# Altium schematic sheet 8-Controller.SchDoc
size A; SPICEModelCacheDTLPPUMU: <root> / <DocumentId>DTLPPUMU</DocumentId> / <CacheFrame Number="0"> / <Model Name="xtal" Kind="CKT"> / <Text>*Generic type:crystal pkg:HC33/51 / .SUBCKT XTAL 1 2 PARAMS: FREQ=1Meg RS=750 C=13pf Q=1000 / LX 1 3 {((Q*RS)/(6.2831852*FREQ))} IC=0.5M / CX 3 4 {(1/(Q*6.2831852*FREQ*RS))} / C0 1 2 {C} / RS 4 2 {RS} / .ENDS XTAL</Text> / </Model> / </CacheFrame> / </root>
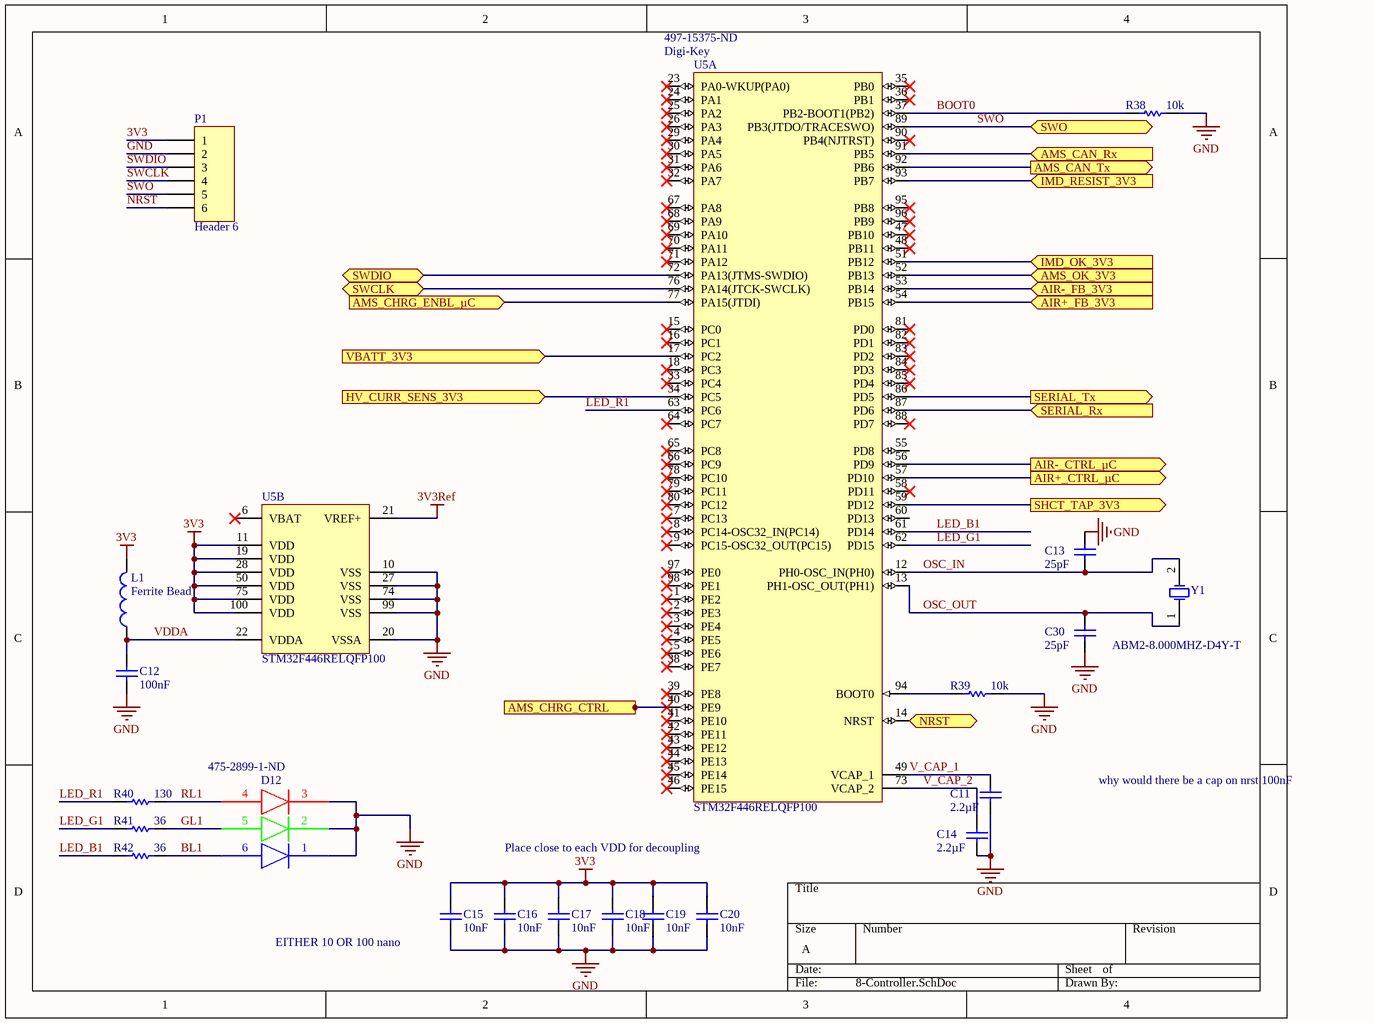
[diagram p0: 8-Controller.SchDoc]

## Parts
C11  Capacitance: 2.2µF  [1608[0603]]  (hidden comment: Cap)
C12  value 100nF  [1608[0603]]  (hidden comment: Cap)
C13  Capacitance: 25pF  [1608[0603]]  (hidden comment: Cap)
C14  Capacitance: 2.2µF  [1608[0603]]  (hidden comment: Cap)
C15  value 10nF  [1608[0603]]  (hidden comment: Cap)
C16  value 10nF  [1608[0603]]  (hidden comment: Cap)
C17  value 10nF  [1608[0603]]  (hidden comment: Cap)
C18  value 10nF  [1608[0603]]  (hidden comment: Cap)
C19  value 10nF  [1608[0603]]  (hidden comment: Cap)
C20  value 10nF  [1608[0603]]  (hidden comment: Cap)
C30  Capacitance: 25pF  [1608[0603]]  (hidden comment: Cap)
D12  Supplier Part Number 1: 475-2899-1-ND  [CLX6C-FKB]
L1  Ferrite Bead  [1608[0603]]
P1  Header 6  [HDR1X6]
R38  value 10k  [1608[0603]]  (hidden comment: Res1)
R39  value 10k  [1608[0603]]  (hidden comment: Res1)
R40  value 130  [1608[0603]]  (hidden comment: Res1)
R41  value 36  [1608[0603]]  (hidden comment: Res1)
R42  value 36  [1608[0603]]  (hidden comment: Res1)
U5  STM32F446RELQFP100  Supplier 1: Digi-Key  Supplier Part Number 1: 497-15375-ND  [STM-LQFP100_L]  (parts A,B of 2)
Y1  ABM2-8.000MHZ-D4Y-T  [ABM2-8.000MHZ-D4Y-T]

## Ports
AIR+_CTRL_µC (out), AIR+_FB_3V3 (in), AIR-_CTRL_µC (out), AIR-_FB_3V3 (in), AMS_CAN_Rx (in), AMS_CAN_Tx (out), AMS_CHRG_CTRL (in), AMS_CHRG_ENBL_µC (in), AMS_OK_3V3 (in), HV_CURR_SENS_3V3 (in), IMD_OK_3V3 (in), IMD_RESIST_3V3 (in), NRST (bidir), SERIAL_Rx (in), SERIAL_Tx (out), SHCT_TAP_3V3 (out), SWCLK (bidir), SWDIO (bidir), SWO (bidir), VBATT_3V3 (in)

## Nets
3V3: C15.2 C16.2 C17.2 C18.2 C19.2 C20.2 L1.2 P1.1 U5.11(VDD) U5.19(VDD) U5.28(VDD) U5.50(VDD) U5.75(VDD) U5.100(VDD)
3V3Ref: U5.21(VREF+)
GND: C11.1 C12.1 C13.2 C14.1 C15.1 C16.1 C17.1 C18.1 C19.1 C20.1 C30.1 D12.1(B) D12.2(G) D12.3(R) P1.2 R38.2 R39.2 U5.10(VSS) U5.20(VSSA) U5.27(VSS) U5.74(VSS) U5.99(VSS)
AIR+_CTRL_µC: U5.57(PD10) ; port AIR+_CTRL_µC
AIR+_FB_3V3: U5.54(PB15) ; port AIR+_FB_3V3
AIR-_CTRL_µC: U5.56(PD9) ; port AIR-_CTRL_µC
AIR-_FB_3V3: U5.53(PB14) ; port AIR-_FB_3V3
AMS_CAN_Rx: U5.91(PB5) ; port AMS_CAN_Rx
AMS_CAN_Tx: U5.92(PB6) ; port AMS_CAN_Tx
AMS_CHRG_CTRL: U5.40(PE9) ; port AMS_CHRG_CTRL
AMS_CHRG_ENBL_µC: U5.77(PA15(JTDI)) ; port AMS_CHRG_ENBL_µC
AMS_OK_3V3: U5.52(PB13) ; port AMS_OK_3V3
BL1: D12.6(B) R42.2
BOOT0: R38.1 U5.37(PB2-BOOT1(PB2))
GL1: D12.5(G) R41.2
HV_CURR_SENS_3V3: U5.34(PC5) ; port HV_CURR_SENS_3V3
IMD_OK_3V3: U5.51(PB12) ; port IMD_OK_3V3
IMD_RESIST_3V3: U5.93(PB7) ; port IMD_RESIST_3V3
LED_B1: R42.1 U5.61(PD14)
LED_G1: R41.1 U5.62(PD15)
LED_R1: R40.1 U5.63(PC6)
NRST: U5.14(NRST) ; port NRST
NRST: P1.6  [a separate net that carries the same name]
OSC_IN: C13.1 U5.12(PH0-OSC_IN(PH0)) Y1.2(OSC2)
OSC_OUT: C30.2 U5.13(PH1-OSC_OUT(PH1)) Y1.1(OSC1)
RL1: D12.4(R) R40.2
SERIAL_Rx: U5.87(PD6) ; port SERIAL_Rx
SERIAL_Tx: U5.86(PD5) ; port SERIAL_Tx
SHCT_TAP_3V3: U5.59(PD12) ; port SHCT_TAP_3V3
SWCLK: U5.76(PA14(JTCK-SWCLK)) ; port SWCLK
SWCLK: P1.4  [a separate net that carries the same name]
SWDIO: U5.72(PA13(JTMS-SWDIO)) ; port SWDIO
SWDIO: P1.3  [a separate net that carries the same name]
SWO: P1.5 U5.89(PB3(JTDO/TRACESWO)) ; port SWO
V_CAP_1: C11.2 U5.49(VCAP_1)
V_CAP_2: C14.2 U5.73(VCAP_2)
VBATT_3V3: U5.17(PC2) ; port VBATT_3V3
VDDA: C12.2 L1.1 U5.22(VDDA)
NetR39_1: R39.1 U5.94(BOOT0)

Not connected (* = marked no-connect by the designer): U5 1(PE2)* 2(PE3)* 3(PE4)* 4(PE5)* 5(PE6)* 6(VBAT)* 7(PC13)* 8(PC14-OSC32_IN(PC14))* 9(PC15-OSC32_OUT(PC15))* 15(PC0)* 16(PC1)* 18(PC3)* 23(PA0-WKUP(PA0))* 24(PA1)* 25(PA2)* 26(PA3)* 29(PA4)* 30(PA5)* 31(PA6)* 32(PA7)* 33(PC4)* 35(PB0)* 36(PB1)* 38(PE7)* 39(PE8)* 41(PE10)* 42(PE11)* 43(PE12)* 44(PE13)* 45(PE14)* 46(PE15)* 47(PB10)* 48(PB11)* 55(PD8) 58(PD11)* 60(PD13) 64(PC7)* 65(PC8)* 66(PC9)* 67(PA8)* 68(PA9)* 69(PA10)* 70(PA11)* 71(PA12)* 78(PC10)* 79(PC11)* 80(PC12)* 81(PD0)* 82(PD1)* 83(PD2)* 84(PD3)* 85(PD4)* 88(PD7)* 90(PB4(NJTRST))* 95(PB8)* 96(PB9)* 97(PE0)* 98(PE1)*

## Notes on the sheet
- why would there be a cap on nrst 100nF
- Place close to each VDD for decoupling
- (near C15) EITHER 10 OR 100 nano

## Library data of the parts
C11 C13 C14 C30 = Cap: Capacitor; Manufacturer: Taiyo Yuden; Manufacturer Part Number: TMK107BBJ225KAHT; Tolerance: ±10%; Voltage - Rated: 25V; Temperature Coefficient: X5R; Category: Capacitors; Applications: General Purpose; Supplier 1: Digi-Key; Supplier Part Number 1: 587-4333-1-ND; RoHS: RoHS Compliant; Stock 1: 6587; Pricing 1: 1=0.28, 10=0.193, 25=0.1416, 50=0.116, 100=0.0979, 250=0.07992, 500=0.06702, 1000=0.05928 (CAD); Packaging: Cut Tape (CT); Part Status: Active; Operating Temperature: -55°C ~ 85°C; Features: -; Ratings: AEC-Q200; Mounting Type: Surface Mount, MLCC; Package / Case: 0603 (1608 Metric); Size / Dimension: 0.063" L x 0.031" W (1.60mm x 0.80mm); Height - Seated (Max): -; Thickness (Max): 0.035" (0.90mm); Lead Spacing: -; Lead Style: -; ComponentLink1URL: http://www.yuden.co.jp/productdata/catalog/en/mlcc_all_hq_e.pdf; ComponentLink1Description: http://www.yuden.co.jp/productdata/catalog/en/mlcc_all_hq_e.pdf
C12 = Cap: Capacitor; Manufacturer: Yageo; Manufacturer Part Number: CC0603KRX7R9BB104; Capacitance: 0.10µF; Tolerance: ±10%; Voltage - Rated: 50V; Temperature Coefficient: X7R; Supplier 1: Digi-Key; Supplier Part Number 1: 311-1344-1-ND; RoHS: RoHS Compliant; Category: Capacitors; Stock 1: 4016262; Pricing 1: 1=0.15, 10=0.043, 25=0.0312, 50=0.0232, 100=0.0189, 250=0.0158, 500=0.01346, 1000=0.01059 (CAD); Packaging: Cut Tape (CT); Part Status: Active; Operating Temperature: -55°C ~ 125°C; Features: -; Ratings: -; Applications: General Purpose; Failure Rate: -; Mounting Type: Surface Mount, MLCC; Package / Case: 0603 (1608 Metric); Size / Dimension: 0.063" L x 0.031" W (1.60mm x 0.80mm); Height - Seated (Max): -; Thickness (Max): 0.035" (0.90mm); Lead Spacing: -; Lead Style: -; ComponentLink1URL: http://www.yageo.com/documents/recent/UPY-GPHC_X7R_6.3V-to-50V_16.pdf; ComponentLink1Description: http://www.yageo.com/documents/recent/UPY-GPHC_X7R_6.3V-to-50V_16.pdf
C15-C20 = Cap: Capacitor; Manufacturer: Yageo; Manufacturer Part Number: CC0603KRX7R9BB103; Capacitance: 10000pF; Tolerance: ±10%; Voltage - Rated: 50V; Temperature Coefficient: X7R; Supplier 1: Digi-Key; Supplier Part Number 1: 311-1085-1-ND; RoHS: RoHS Compliant; Category: Capacitors; Stock 1: 3577285; Pricing 1: 1=0.15, 10=0.026, 25=0.0192, 50=0.0144, 100=0.0117, 250=0.0098, 500=0.00836, 1000=0.00657 (CAD); Packaging: Cut Tape (CT); Part Status: Active; Operating Temperature: -55°C ~ 125°C; Features: -; Ratings: -; Applications: General Purpose; Failure Rate: -; Mounting Type: Surface Mount, MLCC; Package / Case: 0603 (1608 Metric); Size / Dimension: 0.063" L x 0.031" W (1.60mm x 0.80mm); Height - Seated (Max): -; Thickness (Max): 0.035" (0.90mm); Lead Spacing: -; Lead Style: -; ComponentLink1URL: http://www.yageo.com/documents/recent/UPY-GPHC_X7R_6.3V-to-50V_16.pdf; ComponentLink1Description: http://www.yageo.com/documents/recent/UPY-GPHC_X7R_6.3V-to-50V_16.pdf
D12 = LED - CLX6C-FKB-CGJKNCFBB789363 RGB: Manufacturer: Cree Inc.; Color: Red, Green, Blue (RGB); Lens Color: White; Lens Transparency: Diffused; Millicandela Rating: 420mcd Red, 840mcd Green, 196mcd Blue; Lens Style/Size: Square with Flat Top, 1.00mm; Voltage - Forward (Vf) (Typ): 1.9V Red, 3V Green, 3V Blue; Current - Test: 8mA Red, 8mA Green, 8mA Blue; Wavelength - Dominant: 622nm Red, 531nm Green, 470nm Blue; Manufacturer Part Number: CLX6C-FKB-CGJKNCFBB789363; RoHS: RoHS Compliant; Category: Optoelectronics; Packaging: Cut Tape (CT); Part Status: Active; Viewing Angle: -; Mounting Type: Surface Mount; Wavelength - Peak: -; Features: -; Package / Case: 6-SMD, J-Lead; Supplier Device Package: 6-PLCC; Size / Dimension: 3.40mm L x 3.40mm W; Height (Max): 2.90mm; ComponentLink1URL: http://www.cree.com/~/media/Files/Cree/LED-Components-and-Modules/HB/Data-Sheets/1281-CLX6C-FKB.pdf; ComponentLink1Description: http://www.cree.com/~/media/Files/Cree/LED-Components-and-Modules/HB/Data-Sheets/1281-CLX6C-FKB.pdf; Supplier 1: Digi-Key
L1 = Inductor: Code_IEC: 1005; Published: 8-Jun-2000; LatestRevisionDate: 29-May-2009; LatestRevisionNote: IPC-7351 Footprint Added.; PackageReference: 0402-A; Publisher: Altium Limited; PackageDescription: Chip Inductor; Code_JEITA: 0402; Supplier 1: Digi-Key; Supplier Part Number 1: 240-2369-1-ND
P1 = Header 6: Header, 6-Pin; LatestRevisionDate: 17-Jul-2002; LatestRevisionNote: Re-released for DXP Platform.; Publisher: Altium Limited
R38 R39 = Res1: Resistor; Manufacturer: Yageo; Manufacturer Part Number: RC0603JR-0710KL; Tolerance: ±5%; Power (Watts): 0.1W, 1/10W; Temperature Coefficient: ±100ppm/°C; Supplier 1: Digi-Key; Supplier Part Number 1: 311-10KGRCT-ND; RoHS: RoHS Compliant; Category: Resistors; Stock 1: 2936292; Pricing 1: 1=0.16, 10=0.016, 25=0.0112, 50=0.0084, 100=0.0062, 250=0.0048, 500=0.00382, 1000=0.00281 (CAD); Packaging: Cut Tape (CT); Part Status: Active; Resistance (Ohms): 10k; Composition: Thick Film; Features: Moisture Resistant; Operating Temperature: -55°C ~ 155°C; Package / Case: 0603 (1608 Metric); Supplier Device Package: 0603; Size / Dimension: 0.063" L x 0.031" W (1.60mm x 0.80mm); Height - Seated (Max): 0.022" (0.55mm); Number of Terminations: 2; Failure Rate: -; ComponentLink1URL: http://www.yageo.com/NewPortal/yageodocoutput?fileName=/pdf/R-Chip/PYu-RC_Group_51_RoHS_L_4.pdf; ComponentLink1Description: http://www.yageo.com/NewPortal/yageodocoutput?fileName=/pdf/R-Chip/PYu-RC_Group_51_RoHS_L_4.pdf
R40 = Res1: Resistor; Manufacturer: Yageo; Manufacturer Part Number: RC0603JR-07130RL; Tolerance: ±5%; Power (Watts): 0.1W, 1/10W; Temperature Coefficient: ±100ppm/°C; Supplier 1: Digi-Key; Supplier Part Number 1: 311-130GRCT-ND; RoHS: RoHS Compliant; Category: Resistors; Stock 1: 74185; Pricing 1: 1=0.16, 10=0.016, 25=0.0112, 50=0.0084, 100=0.0062, 250=0.0048, 500=0.00382, 1000=0.00281 (CAD); Packaging: Cut Tape (CT); Part Status: Active; Resistance (Ohms): 130; Composition: Thick Film; Features: Moisture Resistant; Operating Temperature: -55°C ~ 155°C; Package / Case: 0603 (1608 Metric); Supplier Device Package: 0603; Size / Dimension: 0.063" L x 0.031" W (1.60mm x 0.80mm); Height - Seated (Max): 0.022" (0.55mm); Number of Terminations: 2; Failure Rate: -; ComponentLink1URL: http://www.yageo.com/NewPortal/yageodocoutput?fileName=/pdf/R-Chip/PYu-RC_Group_51_RoHS_L_4.pdf; ComponentLink1Description: http://www.yageo.com/NewPortal/yageodocoutput?fileName=/pdf/R-Chip/PYu-RC_Group_51_RoHS_L_4.pdf
R41 R42 = Res1: Resistor; Manufacturer: Yageo; Manufacturer Part Number: RC0603JR-0736RL; Tolerance: ±5%; Power (Watts): 0.1W, 1/10W; Temperature Coefficient: ±100ppm/°C; Supplier 1: Digi-Key; Supplier Part Number 1: 311-36GRCT-ND; RoHS: RoHS Compliant; Category: Resistors; Stock 1: 43300; Pricing 1: 1=0.16, 10=0.016, 25=0.0112, 50=0.0084, 100=0.0062, 250=0.0048, 500=0.00382, 1000=0.00281 (CAD); Packaging: Cut Tape (CT); Part Status: Active; Resistance (Ohms): 36; Composition: Thick Film; Features: Moisture Resistant; Operating Temperature: -55°C ~ 155°C; Package / Case: 0603 (1608 Metric); Supplier Device Package: 0603; Size / Dimension: 0.063" L x 0.031" W (1.60mm x 0.80mm); Height - Seated (Max): 0.022" (0.55mm); Number of Terminations: 2; Failure Rate: -; ComponentLink1URL: http://www.yageo.com/NewPortal/yageodocoutput?fileName=/pdf/R-Chip/PYu-RC_Group_51_RoHS_L_4.pdf; ComponentLink1Description: http://www.yageo.com/NewPortal/yageodocoutput?fileName=/pdf/R-Chip/PYu-RC_Group_51_RoHS_L_4.pdf
U5 = CMP-0243-00042-2: ARM Cortex-M4 32-bit MCU+FPU, 225 DMIPS, 2048 kB Flash, 256 kB Internal RAM, 81 I/Os, 100-pin LQFP, -40 to 85 degC, Tray; PartNumber: STM32F439VIT6; Manufacturer: STMicroelectronics; Manufacturer Part Number: STM32F446VET6; FLASH Size (Prog) (kB): 2048; Supply Voltage(Vcc) max (V): 3.6; I/Os (High Current): 82; Supply Voltage(Vcc) min (V): 1.8; Operating Frequency(F) (Processor speed) (MHz): 180; Internal RAM Size (kB): 256; D/A Converter: 2x12-bit; Core Processor: ARM® Cortex®-M4; Speed: 180MHz; Connectivity: CAN, EBI/EMI, I²C, IrDA, LIN, SAI, SD, SPDIF-Rx, SPI, UART/USART, USB, USB OTG; Peripherals: Brown-out Detect/Reset, DMA, I²S, LVD, POR, PWM, WDT; Number of I/O: 81; Program Memory Size: 512KB (512K x 8); RAM Size: 128K x 8; Voltage - Supply (Vcc/Vdd): 1.7 V ~ 3.6 V; Data Converters: A/D 16x12b, D/A 2x12b; Rule: UNIONINDEX=0|RULEKIND=Clearance|NETSCOPE=DifferentNets|LAYERKIND=SameLayer|NAME=Schematic Clearance Constraint|GAP=10mil|GENERICCLEARANCE=10mil|IGNOREPADTOPADCLEARANCEINFOOTPRINT=FALSE|OBJECTCLEARANCES=ClearanceObj_Arc-ClearanceObj_Hole:0;ClearanceObj_Track-ClearanceObj_Hole:0;ClearanceObj_SMDPad-ClearanceObj_Hole:0;ClearanceObj_THPad-ClearanceObj_Hole:0;ClearanceObj_Via-ClearanceObj_Hole:0;ClearanceObj_Fill-ClearanceObj_Hole:0;ClearanceObj_Poly-ClearanceObj_Hole:0;ClearanceObj_Region-ClearanceObj_Hole:0;ClearanceObj_Text-ClearanceObj_Hole:0|UNIT=Imperial; Rule: UNIONINDEX=0|RULEKIND=Width|NETSCOPE=AnyNet|LAYERKIND=SameLayer|NAME=Schematic Width Constraint|MAXLIMIT=10mil|MINLIMIT=5mil|PREFEREDWIDTH=10mil|MIDLAYER1_MINWIDTH=10mil|MIDLAYER2_MINWIDTH=10mil|MIDLAYER3_MINWIDTH=10mil|MIDLAYER4_MINWIDTH=10mil|MIDLAYER5_MINWIDTH=10mil|MIDLAYER6_MINWIDTH=10mil|MIDLAYER7_MINWIDTH=10mil|MIDLAYER8_MINWIDTH=10mil|MIDLAYER9_MINWIDTH=10mil|MIDLAYER10_MINWIDTH=10mil|MIDLAYER11_MINWIDTH=10mil|MIDLAYER12_MINWIDTH=10mil|MIDLAYER13_MINWIDTH=10mil|MIDLAYER14_MINWIDTH=10mil|MIDLAYER15_MINWIDTH=10mil|MIDLAYER16_MINWIDTH=10mil|MIDLAYER17_MINWIDTH=10mil|MIDLAYER18_MINWIDTH=10mil|MIDLAYER19_MINWIDTH=10mil|MIDLAYER20_MINWIDTH=10mil|MIDLAYER21_MINWIDTH=10mil|MIDLAYER22_MINWIDTH=10mil|MIDLAYER23_MINWIDTH=10mil|MIDLAYER24_MINWIDTH=10mil|MIDLAYER25_MINWIDTH=10mil|MIDLAYER26_MINWIDTH=10mil|MIDLAYER27_MINWIDTH=10mil|MIDLAYER28_MINWIDTH=10mil|MIDLAYER29_MINWIDTH=10mil|MIDLAYER30_MINWIDTH=10mil|MINIMP=50.000000|MAXIMP=50.000000|FAVIMP=50.000000|UNIT=Imperial; Mounting Technology: Surface Mount; Packing: Tray; PackageReference: LQFP100; Core: ARM Cortex-M4; PackageVersion: Rev. 1, 06/2013; DatasheetVersion: Rev. 2; PackageDescription: 100-Pin Low Profile Quad Flat Package, 14 x 14 mm Body, 0.5 mm Pitch; PartId: 1; RoHS: RoHS Compliant; Category: Integrated Circuits (ICs); Stock 1: 560; Pricing 1: 1=14.71, 10=13.292, 100=11.0054, 500=9.58332, 1000=8.34676 (CAD); Packaging: Tray; Part Status: Active; Core Size: 32-Bit; Program Memory Type: FLASH; EEPROM Size: -; Oscillator Type: Internal; Operating Temperature: -40°C ~ 85°C (TA); Package / Case: 100-LQFP; Supplier Device Package: 100-LQFP (14x14); ComponentLink5Description: ACTUAL DATASHEET; ComponentLink5URL: https://www.st.com/content/ccc/resource/technical/document/datasheet/65/cb/75/50/53/d6/48/24/DM00141306.pdf/files/DM00141306.pdf/jcr:content/translations/en.DM00141306.pdf
Y1 = XTAL: Crystal Oscillator; Published: 8-Jun-2000; LatestRevisionDate: 17-Jul-2002; LatestRevisionNote: Re-released for DXP Platform.; PackageReference: R38; Publisher: Altium Limited; PackageDescription: Crystal, Thru-Hole; 2 Leads; Body 3.1 x 8.2 mm (Dia.xH)